# EAGLE design MCU (EAGLE 8.5.2)
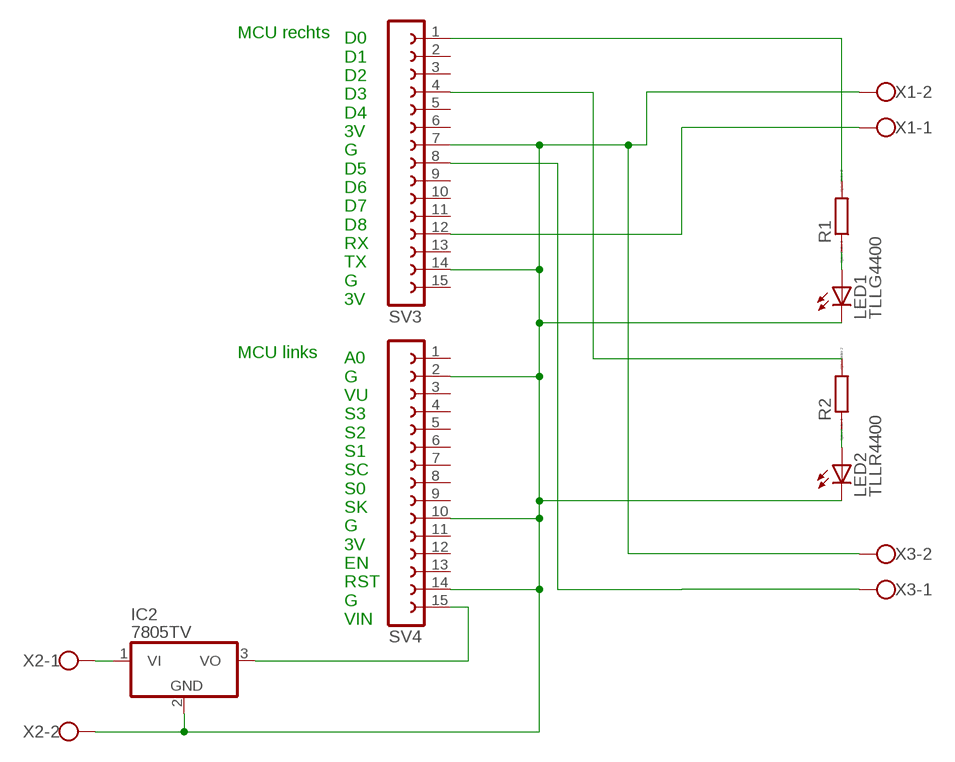
[diagram p0: schematic, sheet 1]

## Parts
IC2  7805TV  [TO220V]
LED1  TLLG4400  [LED3MM]
LED2  TLLR4400  [LED3MM]
R1  R0207/10  [0207/10]
R2  R0207/10  [0207/10]
SV3  FE15-1  [FE15]
SV4  FE15-1  [FE15]
X1  W237-102  [W237-102]
X2  W237-102  [W237-102]
X3  W237-102  [W237-102]

## Nets
G: IC2.2(GND) LED1.K(C) LED2.K(C) SV3.7 SV3.14 SV4.2 SV4.10 SV4.14 X1.2 X2.2 X3.2
N$1: IC2.1(VI) X2.1
N$2: SV3.12 X1.1
N$3: SV3.8 X3.1
N$4: LED2.A R2.1
N$5: LED1.A R1.1
N$6: R1.2 SV3.1
N$7: R2.2 SV3.4
N$15: IC2.3(VO) SV4.15
Unconnected: SV3.2 SV3.3 SV3.5 SV3.6 SV3.9 SV3.10 SV3.11 SV3.13 SV3.15 SV4.1 SV4.3 SV4.4 SV4.5 SV4.6 SV4.7 SV4.8 SV4.9 SV4.11 SV4.12 SV4.13

## Notes on the sheet
- MCU rechts
- D0
  D1
  D2
  D3
  D4
  3V
  G
  D5
  D6
  D7
  D8
  RX
  TX
  G
  3V
- MCU links
- A0
  G
  VU
  S3
  S2
  S1
  SC
  S0
  SK
  G
  3V
  EN
  RST
  G
  VIN

## Library data of the parts
IC2 = linear:78*: Positive VOLTAGE REGULATOR Source: http://cache.national.com/ds/LM/LM78L05.pdf http://www.fairchildsemi.com/ds/LM/LM7805.pdf
LED1 = led:TLLG4400: Low Current (2mA) LED 3 mm Tinted Diffused Package color GREEN Source: Data sheet <http://www.farnell.com/datasheets/391098.pdf>; MF: VISHAY SEMICONDUCTOR; OC_FARNELL: 1612435
LED2 = led:TLLR4400: Low Current (2mA) LED 3 mm Tinted Diffused Package color RED Source: Data sheet <http://www.farnell.com/datasheets/391100.pdf>; MF: VISHAY SEMICONDUCTOR; OC_FARNELL: 1612437
R1 R2 = eagle-ltspice:R: RESISTOR, European symbol; SPICEMODEL: NONE; SPICEPREFIX: R
SV3 SV4 = con-lsta:FE15-1: FEMALE HEADER; OC_FARNELL: unknown; OC_NEWARK: unknown
X1-X3 = con-wago-500:W237-102: WAGO SCREW CLAMP; MPN: 237-102; OC_FARNELL: unknown; OC_NEWARK: 70K9898

## Board
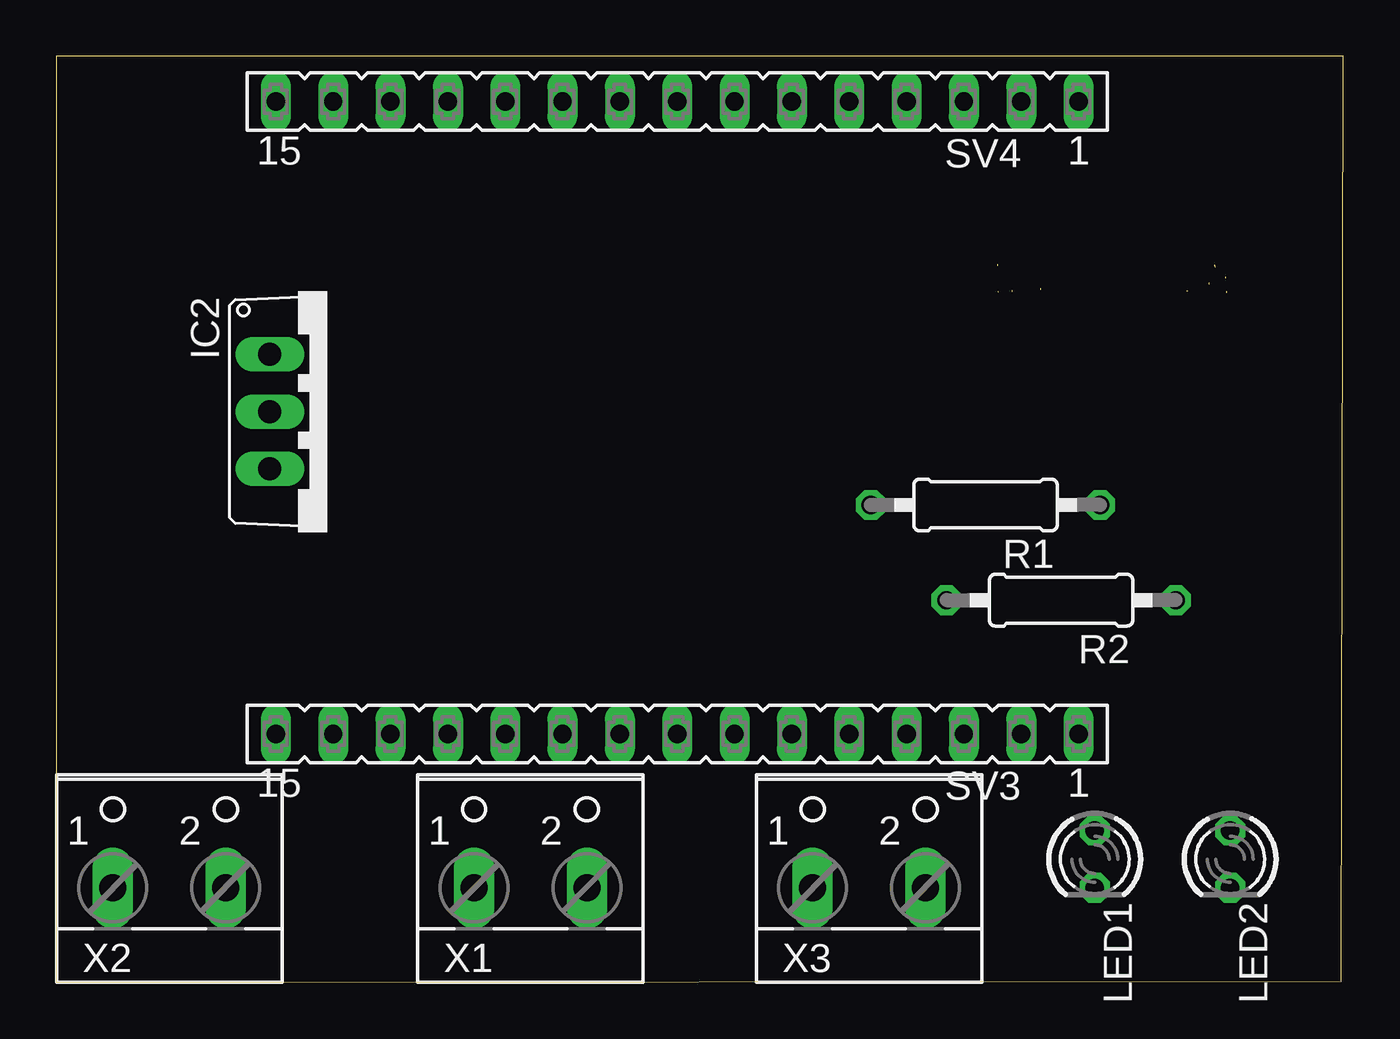
[diagram p1: board, top side]
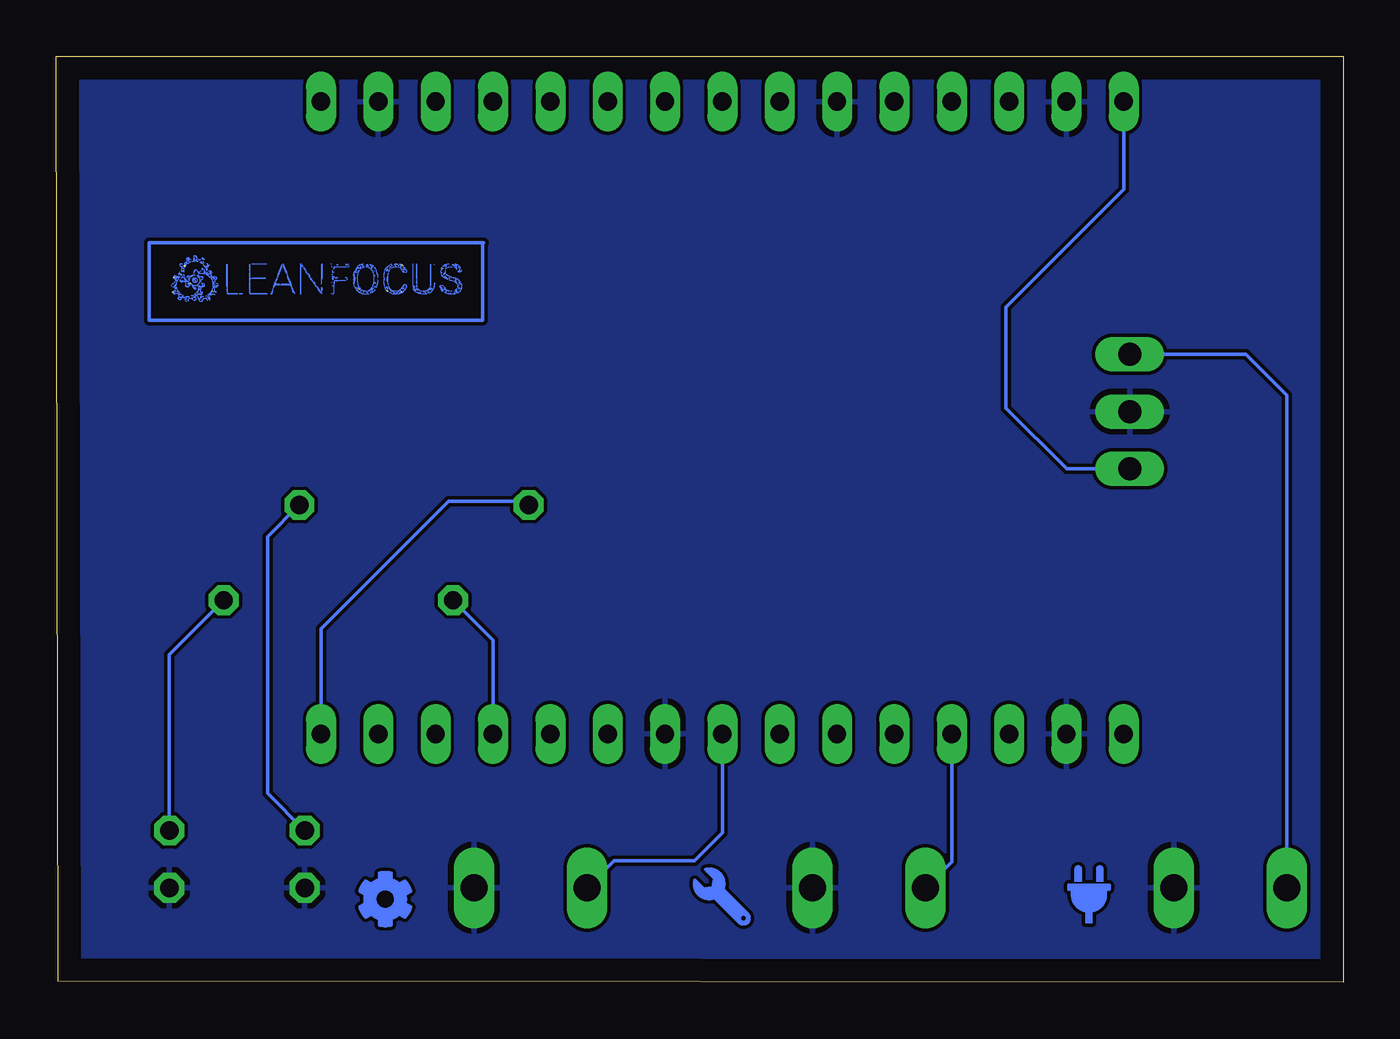
[diagram p2: board, bottom side, seen from below]

Size 57 x 41 mm. Coordinates in mm from the lower left corner, seen from the top.
Outline: 0,0 56.93,0.04 57,41 0,41 0,0
Copper layers (1*16): Top 0.035mm / dielectric 1.5mm / Bottom 0.035mm
Design rules "default": minimum track width 6mil, minimum drill 0.35mm, track to track 6mil, track to pad 6mil, pad to pad 6mil, via to via 6mil, smd to smd 6mil, copper to edge 40mil, drill to drill 6mil, minimum pad ring 10mil, minimum via ring 8mil, stop-mask expansion 4mil, vias tented up to drill 0mil, thermal gap 10mil

### Footprints (pad centres in the part's own frame; a part is rotated, then mirrored left to right if it is on the bottom)
TO220V = drill 1.016 long: 1 -2.54,-2.54; 2 0,-2.54; 3 2.54,-2.54
LED3MM = drill 0.813 octagon: A -1.27,0; K 1.27,0
0207/10 = drill 0.813 octagon: 1 -5.08,0; 2 5.08,0
FE15 = drill 0.813 long: 1 -17.78,0; 2 -15.24,0; 3 -12.7,0; 4 -10.16,0; 5 -7.62,0; 6 -5.08,0; 7 -2.54,0; 8 0,0; 9 2.54,0; 10 5.08,0; 11 7.62,0; 12 10.16,0; 13 12.7,0; 14 15.24,0; 15 17.78,0
W237-102 = drill 1.194 long: 1 -2.5,-1.27; 2 2.5,-1.27

### Placement (x,y rotation side)
IC2  11.99,25.27 270 top
LED1  46,5.45 270 top
LED2  52,5.45 270 top
R1  41.16,21.14 180 top
R2  44.51,16.92 180 top
SV3  27.5,11 180 top
SV4  27.5,39 180 top
X1  21,5.45 0 top
X2  5,5.45 0 top
X3  36,5.45 0 top

### Tracks (layer width: path | path; a pad name or v marks a point on that pad's centre or on a via)
G
  pour Bottom: 0,41 57,41 57,0 0,0
N$1
  Bottom 0.152: X2.1 2.5,26 4.32,27.81 IC2.1
N$2
  Bottom 0.152: X1.1 17.34,5.34 SV3.12
N$3
  Bottom 0.152: X3.1 32.3,5.38 28.73,5.38 27.5,6.61 SV3.8
N$4
  Bottom 0.152: R2.1 52,14.51 LED2.A
N$5
  Bottom 0.152: R1.1 47.65,19.73 47.65,8.37 LED1.A
N$6
  Bottom 0.152: SV3.1 45.28,15.65 39.62,21.31 36.25,21.31 R1.2
N$7
  Bottom 0.152: SV3.4 37.66,15.15 R2.2
N$8
  Bottom 0.152: 38.08,32.76 52.88,32.76 52.88,29.34
N$9
  Bottom 0.152: 52.88,29.32 38.12,29.32 38.12,32.74
N$15
  Bottom 0.152: IC2.3 12.24,22.73 14.94,25.43 14.94,29.9 9.72,35.11 SV4.15
(copper drawn outside any net)
  shapes: Bottom area x4391